# Altium project Small Device Board.PrjPcb
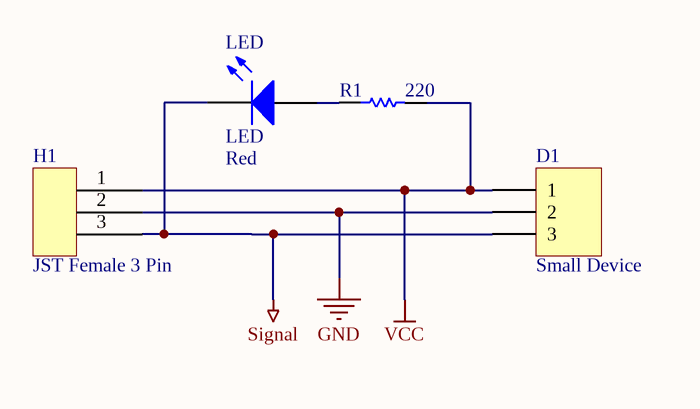
[diagram p0: main.SchDoc]
1 sheet, 4 parts. Net scope: global (net labels, ports and power ports of the same name join across sheets).
Board file: main.PcbDoc

## Sheet main.SchDoc
size OrCAD A; SheetNumber: 1; SheetTotal: 1

### Parts
D1  Small Device  [HDR1X3]
H1  JST Female 3 Pin  [Jst Female 3pin]
LED  LED  Color: Red  [Small Blue LED]
R1  value 220  [AXIAL-0.3]  (hidden comment: Res1)

### Nets
GND: D1.2 H1.2
Signal: D1.3 H1.3 LED.2(K)
VCC: D1.1 H1.1 R1.2
NetLED_1: LED.1(A) R1.1

### Library data of the parts
D1 = Header 3: Header, 3-Pin; LatestRevisionDate: 17-Jul-2002; LatestRevisionNote: Re-released for DXP Platform.; Publisher: Altium Limited
LED = Small LED: 3mm LED
R1 = Res1: Resistor; Published: 8-Jun-2000; LatestRevisionDate: 17-Jul-2002; LatestRevisionNote: Re-released for DXP Platform.; PackageReference: AXIAL-0.3; Publisher: Altium Limited; PackageDescription: Axial Device, Thru-Hole; 2 Leads; 0.3 in Pin Spacing